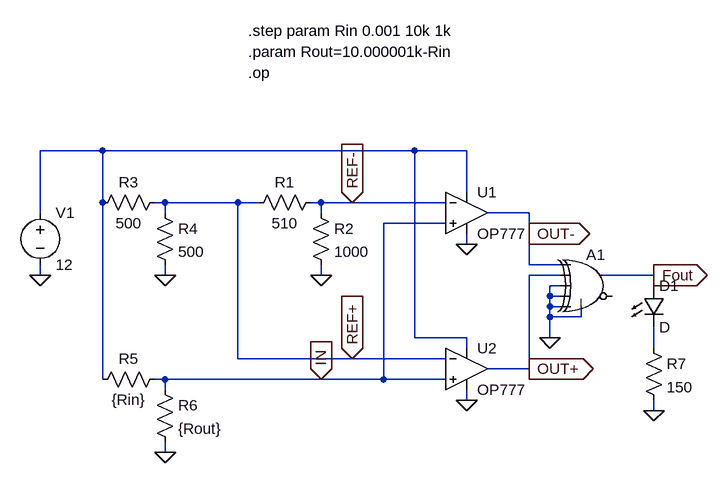
[diagram p0: schematic NivelElectronico.asc]
NivelElectronico.asc, the LTspice schematic file:
Version 4.1
SHEET 1 1136 680
WIRE 176 32 80 32
WIRE 656 32 176 32
WIRE 736 32 656 32
WIRE 736 96 736 32
WIRE 176 112 176 32
WIRE 272 112 256 112
WIRE 384 112 272 112
WIRE 416 112 384 112
WIRE 512 112 496 112
WIRE 560 112 512 112
WIRE 704 112 560 112
WIRE 80 128 80 32
WIRE 272 128 272 112
WIRE 512 128 512 112
WIRE 832 128 768 128
WIRE 704 144 608 144
WIRE 832 160 832 128
WIRE 736 176 736 160
WIRE 832 208 832 160
WIRE 880 208 832 208
WIRE 80 224 80 208
WIRE 272 224 272 208
WIRE 512 224 512 208
WIRE 880 224 832 224
WIRE 1024 224 944 224
WIRE 880 240 864 240
WIRE 1024 240 1024 224
WIRE 864 256 864 240
WIRE 880 256 864 256
WIRE 864 272 864 256
WIRE 880 272 864 272
WIRE 864 288 864 272
WIRE 912 288 912 272
WIRE 912 288 864 288
WIRE 656 320 656 32
WIRE 736 320 656 320
WIRE 864 320 864 288
WIRE 736 336 736 320
WIRE 1024 336 1024 304
WIRE 384 352 384 112
WIRE 560 352 384 352
WIRE 704 352 560 352
WIRE 832 368 832 224
WIRE 832 368 768 368
WIRE 176 384 176 112
WIRE 272 384 256 384
WIRE 512 384 272 384
WIRE 608 384 608 144
WIRE 608 384 512 384
WIRE 704 384 608 384
WIRE 272 400 272 384
WIRE 736 416 736 400
WIRE 1024 432 1024 416
WIRE 272 496 272 480
FLAG 512 224 0
FLAG 272 224 0
FLAG 272 496 0
FLAG 736 416 0
FLAG 736 176 0
FLAG 1024 432 0
FLAG 864 320 0
FLAG 80 224 0
FLAG 560 352 REF+
IOPIN 560 352 In
FLAG 560 112 REF-
IOPIN 560 112 In
FLAG 512 384 IN
IOPIN 512 384 In
FLAG 832 160 OUT-
IOPIN 832 160 Out
FLAG 832 368 OUT+
IOPIN 832 368 Out
FLAG 1024 224 Fout
IOPIN 1024 224 Out
SYMBOL voltage 80 112 R0
SYMATTR InstName V1
SYMATTR Value 12
SYMBOL res 512 96 R90
WINDOW 0 0 56 VBottom 2
WINDOW 3 32 56 VTop 2
SYMATTR InstName R1
SYMATTR Value 510
SYMBOL res 496 112 R0
SYMATTR InstName R2
SYMATTR Value 1000
SYMBOL res 272 96 R90
WINDOW 0 0 56 VBottom 2
WINDOW 3 32 56 VTop 2
SYMATTR InstName R3
SYMATTR Value 500
SYMBOL res 256 112 R0
SYMATTR InstName R4
SYMATTR Value 500
SYMBOL res 272 368 R90
WINDOW 0 0 56 VBottom 2
WINDOW 3 32 56 VTop 2
SYMATTR InstName R5
SYMATTR Value {Rin}
SYMBOL res 256 384 R0
SYMATTR InstName R6
SYMATTR Value {Rout}
SYMBOL OpAmps\\OP777 736 64 R0
SYMATTR InstName U1
SYMBOL OpAmps\\OP777 736 304 R0
SYMATTR InstName U2
SYMBOL Digital\\xor 928 176 R0
SYMATTR InstName A1
SYMBOL LED 1008 240 R0
SYMATTR InstName D1
SYMBOL res 1008 320 R0
SYMATTR InstName R7
SYMATTR Value 150
TEXT 400 -152 Left 2 !.step param Rin 0.001 10k 1k
TEXT 400 -120 Left 2 !.param Rout=10.000001k-Rin
TEXT 400 -88 Left 2 !.op

The netlist it stands for:
* NivelElectronico.asc
V1 N001 0 12
R1 REF- REF+ 510
R2 REF- 0 1000
R3 REF+ N001 500
R4 REF+ 0 500
R5 IN N001 {Rin}
R6 IN 0 {Rout}
X§U1 IN REF- N001 0 OUT- OP777  ; pins In+ In- V+ V- OUT
X§U2 IN REF+ N001 0 OUT+ OP777  ; pins In+ In- V+ V- OUT
A1 OUT- OUT+ 0 0 0 0 Fout 0 XOR
D1 Fout N002 D
R7 N002 0 150
.model D D
.lib standard.dio
.step param Rin 0.001 10k 1k
.param Rout=10.000001k-Rin
.op
.lib ADI.lib
.backanno
.end